# EAGLE design proto4-duplex (EAGLE 9.7.0)
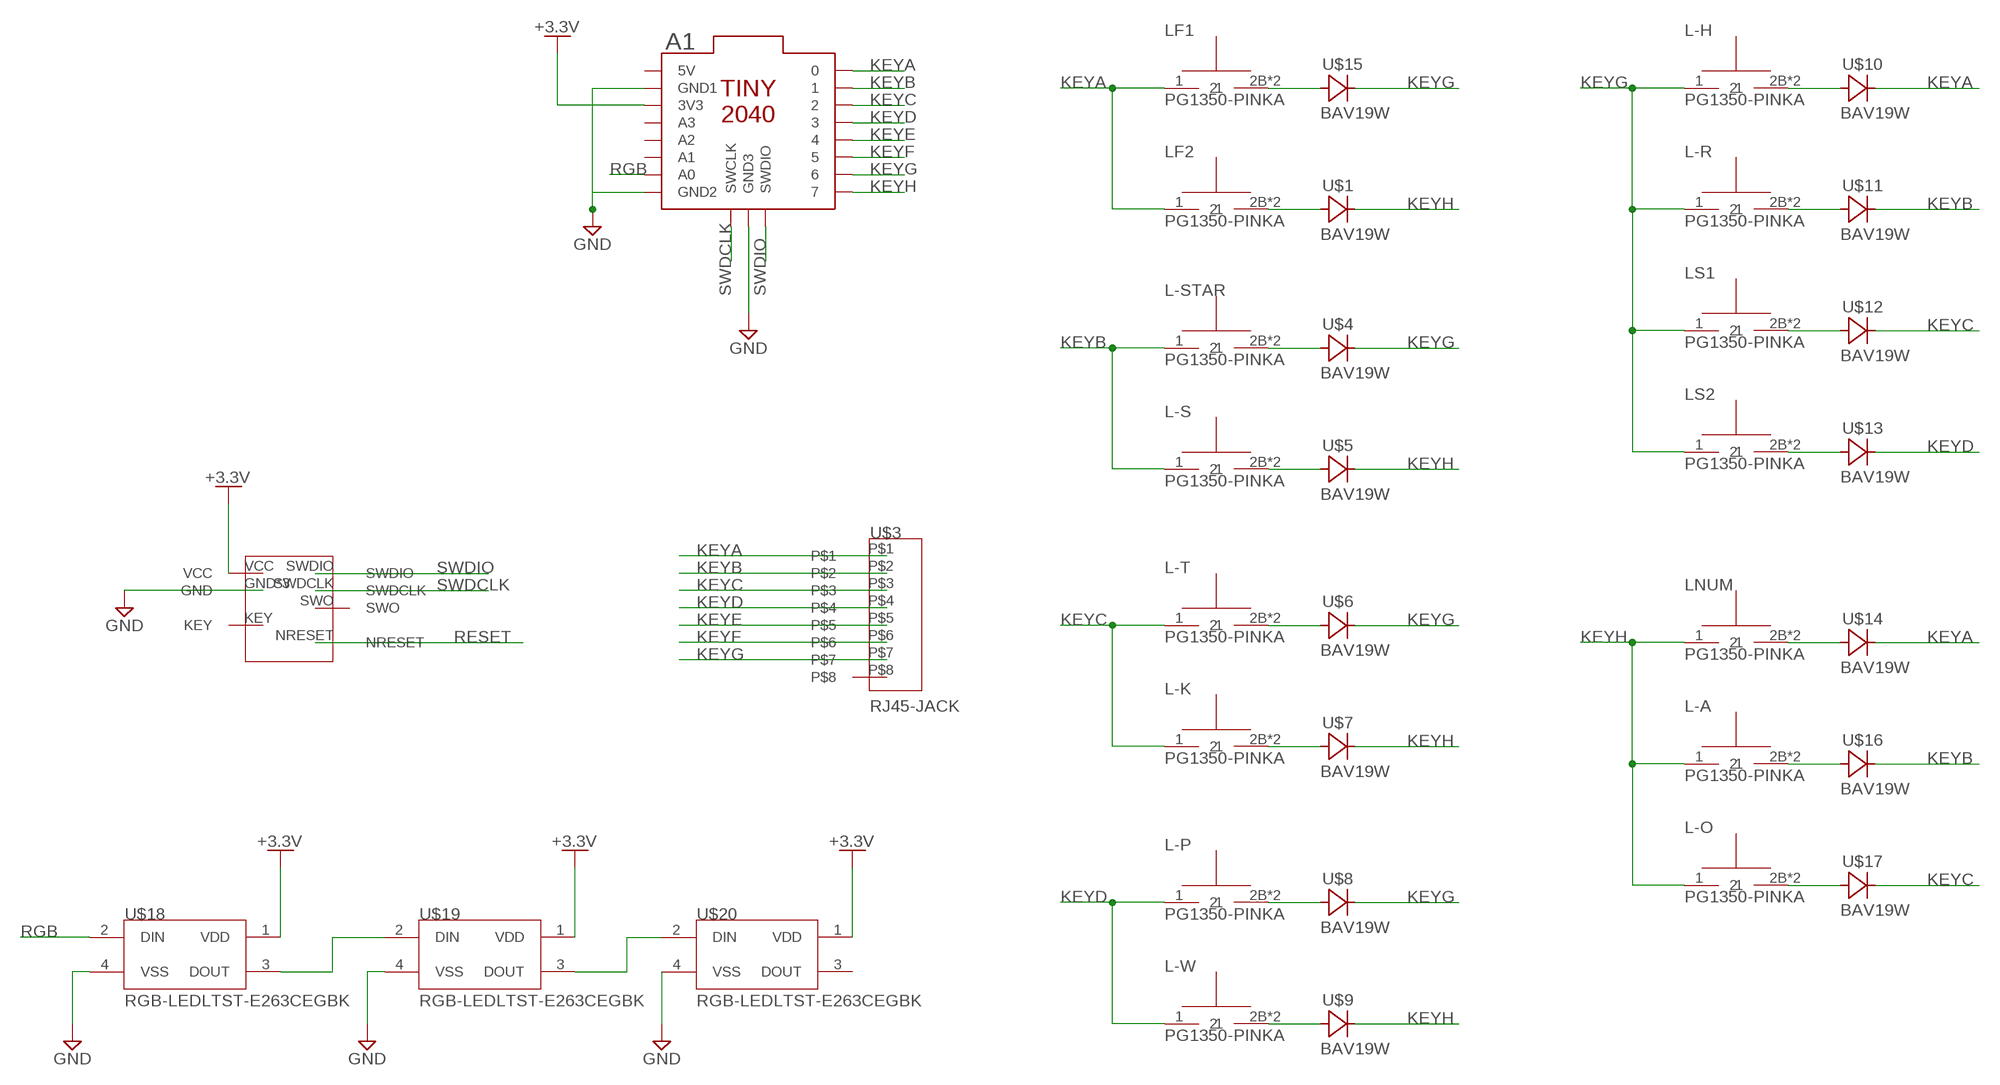
[diagram p0: schematic, sheet 1]

## Parts
A1  TINY2040  [TINY2040]
L-A  PG1350-PINKA  [PG1350]
L-H  PG1350-PINKA  [PG1350]
L-K  PG1350-PINKA  [PG1350]
L-O  PG1350-PINKA  [PG1350]
L-P  PG1350-PINKA  [PG1350]
L-R  PG1350-PINKA  [PG1350]
L-S  PG1350-PINKA  [PG1350]
L-STAR  PG1350-PINKA  [PG1350]
L-T  PG1350-PINKA  [PG1350]
L-W  PG1350-PINKA  [PG1350]
LF1  PG1350-PINKA  [PG1350]
LF2  PG1350-PINKA  [PG1350]
LNUM  PG1350-PINKA  [PG1350]
LS1  PG1350-PINKA  [PG1350]
LS2  PG1350-PINKA  [PG1350]
U$1  BAV19W  [SOD123]
U$2  CORTEX-M0  [CORTEX-M10]
U$3  RJ45-JACK  [C-BMJ-0051-RJ45]
U$4  BAV19W  [SOD123]
U$5  BAV19W  [SOD123]
U$6  BAV19W  [SOD123]
U$7  BAV19W  [SOD123]
U$8  BAV19W  [SOD123]
U$9  BAV19W  [SOD123]
U$10  BAV19W  [SOD123]
U$11  BAV19W  [SOD123]
U$12  BAV19W  [SOD123]
U$13  BAV19W  [SOD123]
U$14  BAV19W  [SOD123]
U$15  BAV19W  [SOD123]
U$16  BAV19W  [SOD123]
U$17  BAV19W  [SOD123]
U$18  RGB-LEDLTST-E263CEGBK  [DFN180X180X65-2]
U$19  RGB-LEDLTST-E263CEGBK  [DFN180X180X65-2]
U$20  RGB-LEDLTST-E263CEGBK  [DFN180X180X65-2]

## Nets
+3.3V: A1.3V3 U$18.1(VDD) U$19.1(VDD) U$20.1(VDD)
GND: A1.GND1 A1.GND2 A1.GND3 U$2.GND U$2.GND2(GND) U$2.GNDDETEC(GND) U$18.4(VSS) U$19.4(VSS) U$20.4(VSS)
KEYA: A1.0 LF1.1 LF2.1 U$3.P$1 U$10.C U$14.C
KEYB: A1.1 L-S.1 L-STAR.1 U$3.P$2 U$11.C U$16.C
KEYC: A1.2 L-K.1 L-T.1 U$3.P$3 U$12.C U$17.C
KEYD: A1.3 L-P.1 L-W.1 U$3.P$4 U$13.C
KEYE: A1.4 U$3.P$5
KEYF: A1.5 U$3.P$6
KEYG: A1.6 L-H.1 L-R.1 LS1.1 LS2.1 U$3.P$7 U$4.C U$6.C U$8.C U$15.C
KEYH: A1.7 L-A.1 L-O.1 LNUM.1 U$1.C U$5.C U$7.C U$9.C
N$1: LF1.2B LF1.2T U$15.A
N$2: LF2.2B LF2.2T U$1.A
N$3: L-STAR.2B L-STAR.2T U$4.A
N$4: L-S.2B L-S.2T U$5.A
N$5: L-T.2B L-T.2T U$6.A
N$6: L-K.2B L-K.2T U$7.A
N$7: L-P.2B L-P.2T U$8.A
N$8: L-W.2B L-W.2T U$9.A
N$9: L-H.2B L-H.2T U$10.A
N$10: L-R.2B L-R.2T U$11.A
N$11: LS1.2B LS1.2T U$12.A
N$12: LS2.2B LS2.2T U$13.A
N$13: LNUM.2B LNUM.2T U$14.A
N$14: L-A.2B L-A.2T U$16.A
N$15: L-O.2B L-O.2T U$17.A
N$16: U$18.3(DOUT) U$19.2(DIN)
N$17: U$19.3(DOUT) U$20.2(DIN)
RESET: U$2.NRESET
RGB: A1.A0 U$18.2(DIN)
SWDCLK: A1.SWCLK U$2.SWDCLK
SWDIO: A1.SWDIO U$2.SWDIO
Unconnected: A1.5V A1.A1 A1.A2 A1.A3 U$2.KEY U$2.SWO U$2.VCC U$3.P$8 U$20.3(DOUT)

## Library data of the parts
A1 = pimoroni-boards:TINY2040
L-A L-H L-K L-O L-P L-R L-S L-STAR L-T L-W LF1 LF2 LNUM LS1 LS2 = Keyboard Parts:PG1350-PINK
U$1 U$4-U$17 = Keyboard Parts:BAV19W
U$2 = Keyboard Parts:CORTEX-M0
U$3 = Keyboard Parts:RJ45-JACK
U$18-U$20 = Keyboard Parts:RGB-LED

## Board
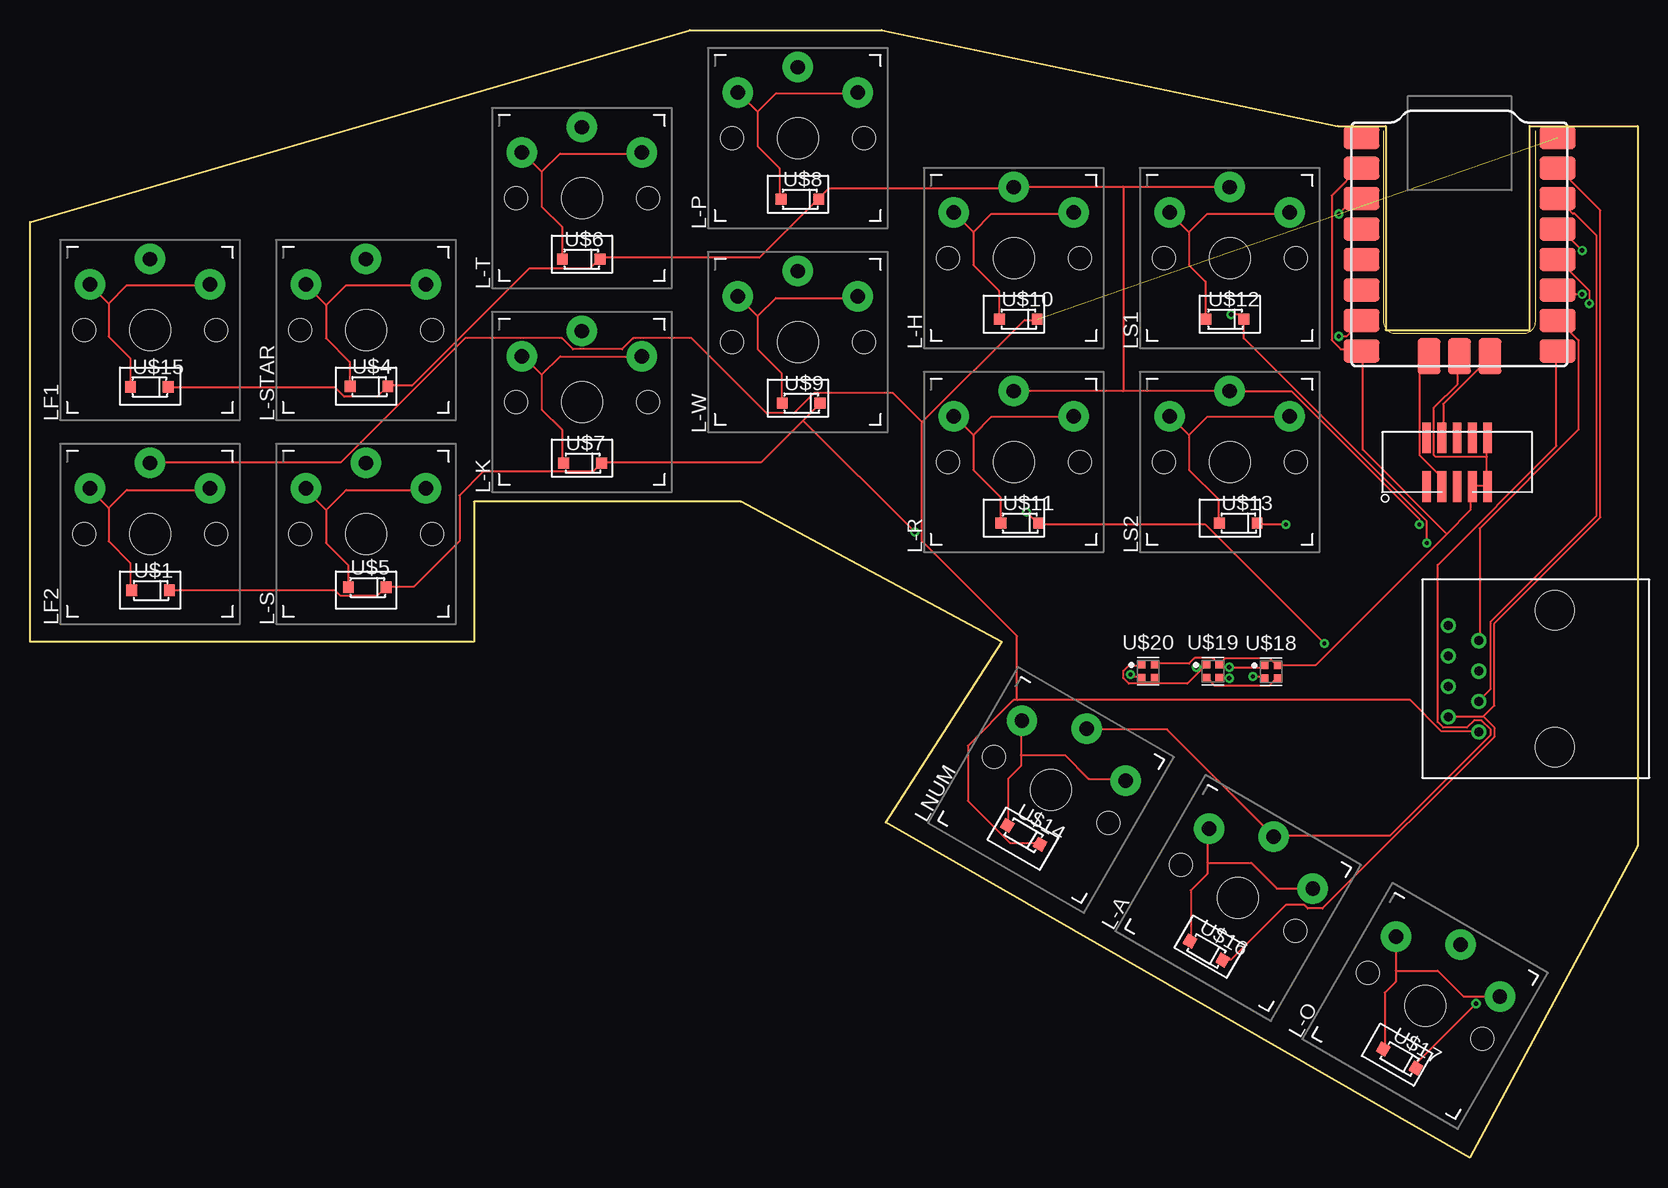
[diagram p1: board, top side]
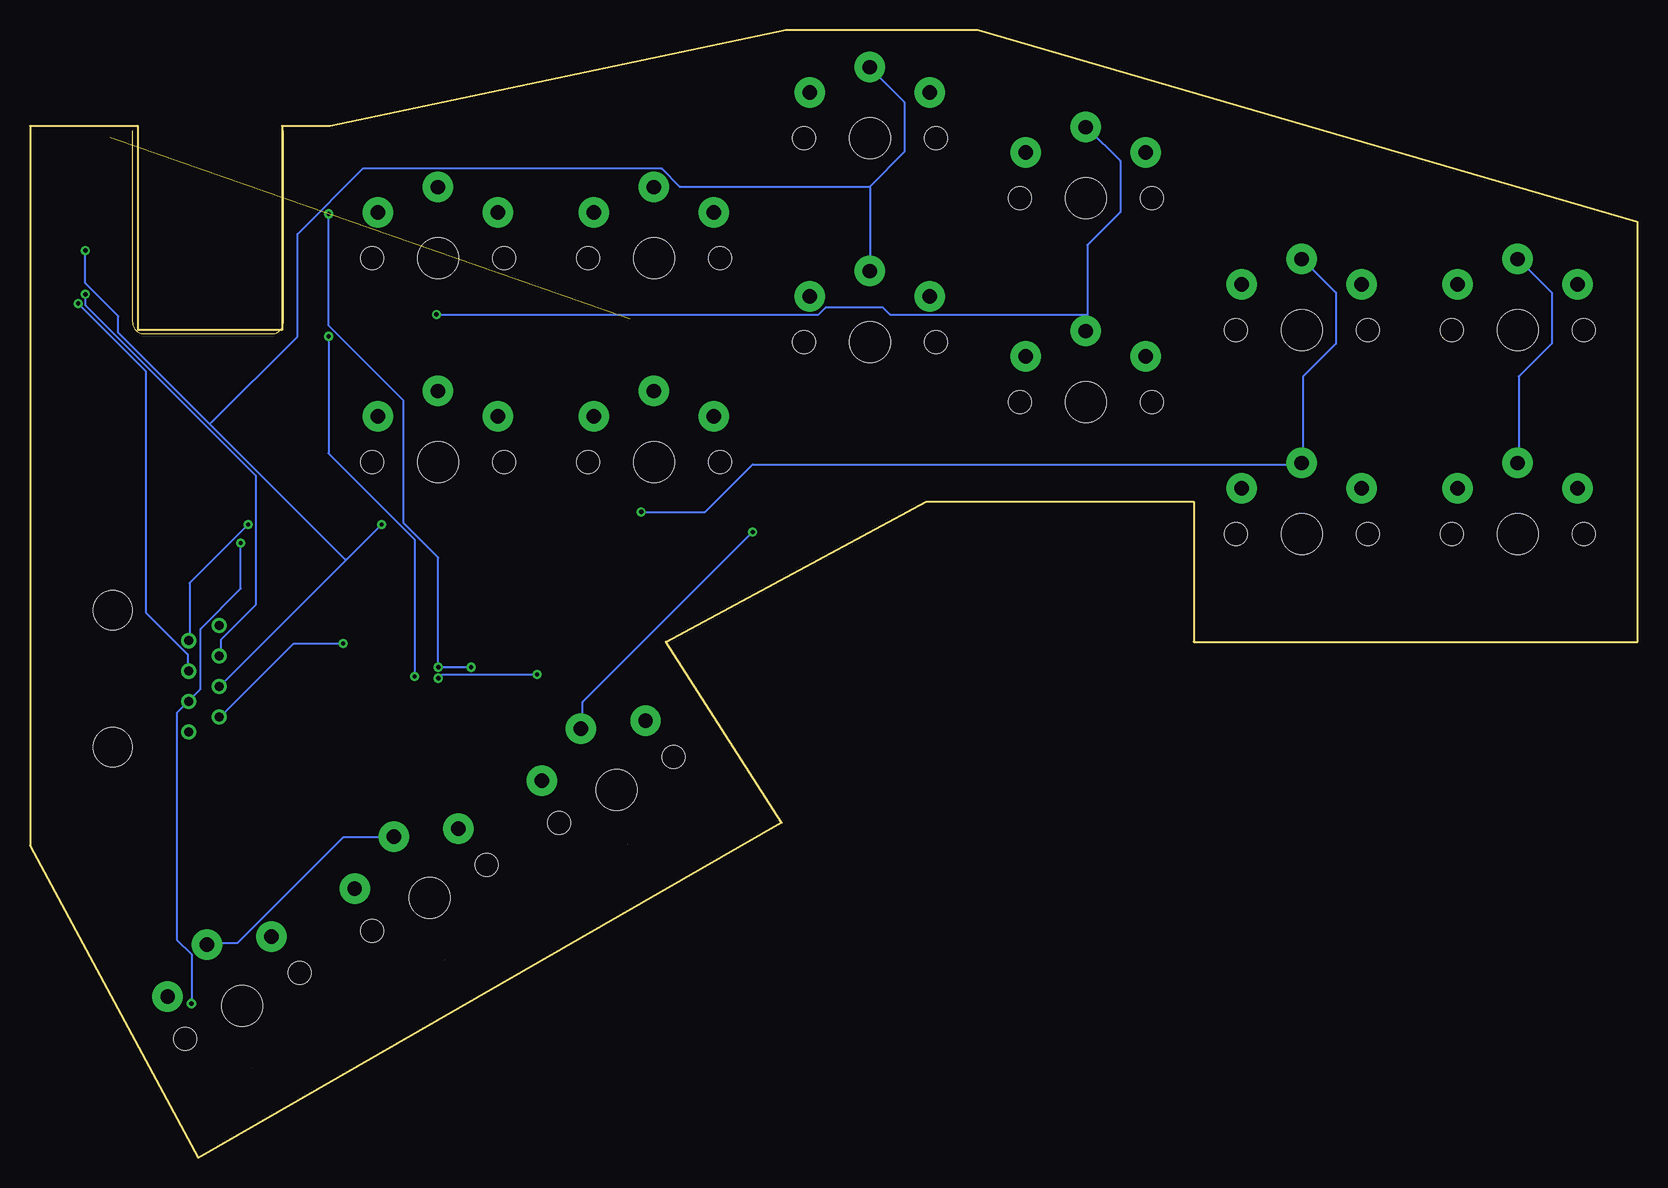
[diagram p2: board, bottom side, seen from below]

Size 134 x 94 mm. Coordinates in mm from the lower left corner, seen from the top.
Outline: 0,78 55,94 71,94 109,86 113,86 113,69 125,69 125,86 134,86 134,26 120,0 71.34,27.93 81,43 59.26,54.67 37,54.67 37,43 0,43 0,78
Copper layers (1*16): Top 0.035mm / dielectric 1.5mm / Bottom 0.035mm
Design rules "Fusion Electronics Design Rules": minimum track width 6mil, minimum drill 0.35mm, track to track 6mil, track to pad 6mil, pad to pad 6mil, via to via 6mil, smd to smd 6mil, copper to edge 40mil, drill to drill 6mil, minimum pad ring 10mil, minimum via ring 8mil, stop-mask expansion 4mil, vias tented up to drill 0mil, thermal gap 10mil

### Footprints (pad centres in the part's own frame; a part is rotated, then mirrored left to right if it is on the bottom)
TINY2040 = smd 1.9 x 3: 0 1.27,8.17; 1 3.81,8.17; 2 6.35,8.17; 3 8.89,8.17; 3V3 6.35,-8.17; 4 11.43,8.17; 5 13.97,8.17; 5V 1.27,-8.17; 6 16.51,8.17; 7 19.05,8.17; A0 16.51,-8.17; A1 13.97,-8.17; A2 11.43,-8.17; A3 8.89,-8.17; GND1 3.81,-8.17; GND2 19.05,-8.17 | smd 3 x 1.9: GND3 19.49,0; SWCLK 19.49,-2.54; SWDIO 19.49,2.54
PG1350 = drill 1.2 pad 2.54: 1 5.9,0; 2B 3.8,5; 2T 3.8,-5 | hole 3.4: 0,0 | hole 1.9: 0,5.5; 0,-5.5
SOD123 = smd 0.9 x 0.95: A -1.575,0; C 1.575,0
CORTEX-M10 = smd 2.55 x 0.74: GND -2.025,-2.54; GND2 2.025,-2.54; GNDDETEC -2.025,-1.27; KEY 2.025,-1.27; NC -2.025,0; NRESET 2.025,0; SWDCLK -2.025,1.27; SWDIO 2.025,1.27; SWO -2.025,2.54; VCC 2.025,2.54
C-BMJ-0051-RJ45 = drill 0.76: P$1 -3.81,0; P$2 -2.54,2.54; P$3 -1.27,0; P$4 0,2.54; P$5 1.27,0; P$6 2.54,2.54; P$7 3.81,0; P$8 5.08,2.54 | hole 3.25: -5.08,-6.35; 6.35,-6.35
DFN180X180X65-2 = smd 0.6 x 0.6: 1 -0.52,0.52; 2 -0.52,-0.52; 3 0.52,-0.52; 4 0.52,0.52

### Placement (x,y rotation side)
A1  119.16,86.29 270 top
L-A  100.71,21.63 60 top
L-H  82,75 90 top
L-K  46,63 90 top
L-O  116.29,12.63 60 top
L-P  64,85 90 top
L-R  82,58 90 top
L-S  28,52 90 top
L-STAR  28,69 90 top
L-T  46,80 90 top
L-W  64,68 90 top
LF1  10,69 90 top
LF2  10,52 90 top
LNUM  85.12,30.63 60 top
LS1  100,75 90 top
LS2  100,58 90 top
U$1  10.05,47.28 0 top
U$2  118.96,57.96 90 top
U$3  120.76,39.28 90 top
U$4  28.26,64.28 0 top
U$5  28.12,47.53 0 top
U$6  45.95,74.9 0 top
U$7  46.06,57.9 0 top
U$8  64.17,79.9 0 top
U$9  64.28,62.9 0 top
U$10  82.39,69.9 0 top
U$11  82.5,52.9 0 top
U$12  99.61,69.9 0 top
U$13  100.72,52.9 0 top
U$14  82.83,26.9 330 top
U$15  9.95,64.25 0 top
U$16  98.06,17.25 330 top
U$17  114.17,8.25 330 top
U$18  103.45,40.5 0 top
U$19  98.6,40.55 0 top
U$20  93.2,40.55 0 top

### Tracks (layer width: path | path; a pad name or v marks a point on that pad's centre or on a via)
+3.3V  (via drill 0.35)
  Top 0.152: 97.53,40.57 97.98,41.02 U$19.1 | 97.53,40.57 96.46,39.5 91.58,39.5 91.13,39.96 91.13,40.57 91.58,41.02 92.65,41.02 U$20.1 | v99.97,40.87 102.86,40.87 U$18.1 | 97.53,40.57 v97.22,40.87 | v109.11,78.67 110.33,79.89 110.94,79.89 A1.3V3
  Bottom 0.152: v97.22,40.87 v99.97,40.87 99.97,50.02 102.86,52.91 102.86,63.12 109.11,69.37 v109.11,78.67
GND
  Top 0.152: A1.GND1 110.94,82.63 108.5,80.19 108.5,68.15 109.26,67.39 110.94,67.39 A1.GND2 111.09,67.24 111.09,59.01 118.1,52 | U$20.4 93.87,41.18 96.61,41.18 97.07,41.64 98.59,41.64 99.05,41.18 U$19.4 99.2,41.18 99.66,41.64 103.32,41.64 103.93,41.02 U$18.4 104.08,41.02 107.13,41.02 118.1,52 | 121.45,55.96 120.24,55.96 U$2.GNDDETEC 120.08,55.81 120.08,53.98 118.1,52 | 121.45,55.96 121.45,58.4 | 121.45,58.4 121.45,59.92 U$2.GND2 | 121.45,55.96 U$2.GND | 121.45,58.4 117.19,58.4 117.03,58.55 117.03,62.51 119.02,64.5 119.02,66.78 A1.GND3
KEYA  (2 unrouted)
  Top 0.152: 82.29,38.13 115.05,38.13 117.65,35.54 120.69,35.54 U$3.P$1 | 82.29,38.13 81.98,38.13 78.17,34.32 78.17,29.75 81.68,26.24 84.12,26.24 U$14.C | 74.36,61.29 82.9,69.83 83.96,69.83 U$10.C | 74.36,61.29 74.36,51.39 82.29,43.46 82.29,38.13 | 74.36,61.29 71.92,63.73 65.37,63.73 63.7,62.06 61.41,62.06 55.16,68.31 50.28,68.31 49.37,67.39 45.25,67.39 44.34,68.31 36.26,68.31 25.9,57.94 10.05,57.94 LF2.1
  Bottom 0.152: LF2.1 9.9,57.94 9.9,65.1 7.16,67.85 7.16,72.11 9.9,74.86 LF1.1
KEYB  (via drill 0.35)  (1 unrouted)
  Top 0.152: v107.89,42.85 97.98,52.76 84.12,52.76 U$11.C 83.96,52.91 v83.05,53.83 | 121.15,36.76 122.06,35.84 122.06,35.08 107.74,20.76 106.52,20.76 106.22,21.06 104.69,21.06 100.12,16.49 99.51,16.49 U$16.C | 121.15,36.76 118.25,36.76 U$3.P$2 | 121.15,36.76 122.06,37.67 122.06,44.53 130.9,53.37 130.9,78.97 127.4,82.48 A1.1
  Bottom 0.152: L-STAR.1 27.88,74.86 25.14,72.11 25.14,67.85 27.88,65.1 27.88,57.94 L-S.1 28.03,57.79 73.75,57.79 77.72,53.83 v83.05,53.83 | v107.89,42.85 112.01,42.85 118.1,36.76 U$3.P$2
KEYC  (via drill 0.35)  (1 unrouted)
  Top 0.152: v120.54,12.83 115.66,7.95 115.66,7.5 U$17.C | v116.43,51.24 116.43,53.06 101.19,68.31 101.19,69.83 U$12.C 101.03,69.98 100.73,70.29 v100.12,70.29 | A1.2 127.4,79.89 128.62,78.67 128.77,78.67 130.6,76.84 130.6,53.52 121.76,44.68 121.76,39.04 120.84,38.13 U$3.P$3
  Bottom 0.152: 45.86,70.29 45.86,76.08 43.12,78.82 43.12,83.09 45.86,85.83 L-T.1 | 45.86,70.29 45.86,68.91 L-K.1 | v120.54,12.83 120.54,16.95 121.76,18.16 121.76,37.06 120.84,37.98 U$3.P$3 120.69,38.13 119.78,39.04 119.78,44.07 116.43,47.43 v116.43,51.24 | 45.86,70.29 62.32,70.29 62.93,70.9 67.66,70.9 68.27,70.29 v100.12,70.29
KEYD  (via drill 0.35)
  Top 0.152: v104.69,52.76 102.41,52.76 U$13.C | v129.38,75.62 127.7,77.3 127.4,77.3 A1.3
  Bottom 0.152: 64,80.95 L-W.1 | 64,80.95 61.1,83.85 61.1,87.96 64,90.86 L-P.1 | 107.59,49.86 118.1,39.35 U$3.P$4 | 107.59,49.86 v104.69,52.76 | v129.38,75.62 129.38,72.88 126.64,70.13 126.64,68.76 119.02,61.14 | 119.02,61.14 107.74,49.86 107.59,49.86 | 64,80.95 79.85,80.95 81.37,82.48 106.22,82.48 111.7,76.99 111.7,68.46 119.02,61.14
KEYE  (via drill 0.35)
  Top 0.152: v129.99,71.2 129.99,72.27 127.4,74.86 A1.4
  Bottom 0.152: v129.99,71.2 124.35,65.56 124.35,45.45 120.84,41.94 120.84,40.57 U$3.P$5
KEYF  (via drill 0.35)
  Top 0.152: v129.38,71.96 127.7,71.96 127.4,72.27 A1.5
  Bottom 0.152: v129.38,71.96 129.38,71.05 115.21,56.88 115.21,46.05 118.1,43.16 118.1,41.94 U$3.P$6
KEYG  (via drill 0.35)
  Top 0.152: U$3.P$7 120.84,43.16 120.84,52.45 129.07,60.69 129.07,68.15 127.4,69.83 A1.6 | 91.13,63.88 99.97,63.88 LS2.1 100.12,63.88 105.15,63.88 115.82,53.22 v115.82,52.76 | 91.13,63.88 82.14,63.88 L-R.1 | U$15.C 11.57,64.19 25.44,64.19 26.2,63.43 28.95,63.43 29.71,64.19 U$4.C 29.86,64.34 31.84,64.34 41.6,74.1 46.63,74.1 47.39,74.86 U$6.C 47.54,75.01 60.8,75.01 65.68,79.89 U$8.C 65.83,80.04 66.59,80.8 81.98,80.8 L-H.1 82.14,80.95 91.13,80.95 | 91.13,80.95 99.97,80.95 LS1.1 | 91.13,80.95 91.13,63.88
  Bottom 0.152: v115.82,52.76 120.69,47.88 120.69,43.16 U$3.P$7
KEYH  (via drill 0.35)
  Top 0.152: U$1.C 11.73,47.27 25.44,47.27 25.9,46.82 28.95,46.82 29.56,47.43 U$5.C 29.71,47.58 32,47.58 35.81,51.39 35.81,55.2 37.79,57.18 46.93,57.18 47.54,57.79 U$7.C 47.69,57.94 60.95,57.94 64.46,61.45 | 64.46,61.45 65.83,62.82 U$9.C | A1.7 127.25,67.24 127.25,59.31 117.34,49.41 117.34,36.3 117.8,35.84 119.78,35.84 120.39,36.45 121,36.45 121.76,35.69 121.76,35.23 113.38,26.85 103.78,26.85 L-A.1 103.62,26.85 94.78,35.69 88.08,35.69 LNUM.1 | v73.75,52.15 64.46,61.45
  Bottom 0.152: L-O.1 119.17,17.86 116.73,17.86 107.89,26.7 103.78,26.7 L-A.1 | v73.75,52.15 87.93,37.98 87.93,35.84 LNUM.1
N$1
  Top 0.152: 6.55,71.2 6.55,68.46 8.37,66.63 8.37,64.34 U$15.A | 6.55,71.2 5.02,72.72 LF1.2B | 6.55,71.2 8.07,72.72 14.93,72.72 LF1.2T
N$2
  Top 0.152: 6.55,54.13 6.55,51.39 8.37,49.56 8.37,47.43 U$1.A | 6.55,54.13 5.02,55.66 LF2.2B | 6.55,54.13 8.07,55.66 14.93,55.66 LF2.2T
N$3
  Top 0.152: 24.68,71.05 24.68,68.31 26.66,66.32 26.66,64.34 U$4.A | 24.68,71.05 23,72.72 L-STAR.2B | 24.68,71.05 26.36,72.72 32.91,72.72 L-STAR.2T
N$4
  Top 0.152: 24.68,53.98 24.68,51.24 26.51,49.41 26.51,47.58 U$5.A | 24.68,53.98 23,55.66 L-S.2B | 24.68,53.98 26.36,55.66 32.91,55.66 L-S.2T
N$5
  Top 0.152: 42.66,82.17 42.66,79.28 44.34,77.6 44.34,75.01 U$6.A | 42.66,82.17 41.14,83.7 L-T.2B | 42.66,82.17 44.19,83.7 50.89,83.7 L-T.2T
N$6
  Top 0.152: 42.66,65.26 42.66,62.36 44.34,60.69 44.34,57.94 U$7.A | 42.66,65.26 41.14,66.78 L-K.2B | 42.66,65.26 44.19,66.78 50.89,66.78 L-K.2T
N$7
  Top 0.152: 60.65,87.2 60.65,84.31 62.48,82.48 62.48,80.04 U$8.A | 60.65,87.2 59.12,88.73 L-P.2B | 60.65,87.2 62.17,88.73 68.88,88.73 L-P.2T
N$8
  Top 0.152: 60.65,70.13 60.65,67.39 62.63,65.41 62.63,62.97 U$9.A | 60.65,70.13 59.12,71.66 L-W.2B | 60.65,70.13 62.17,71.66 68.88,71.66 L-W.2T
N$9
  Top 0.152: 78.63,77.14 78.63,74.4 80.76,72.27 80.76,69.98 U$10.A | 78.63,77.14 77.11,78.67 L-H.2B | 78.63,77.14 80.15,78.67 86.86,78.67 L-H.2T
N$10
  Top 0.152: 78.63,60.23 78.63,57.33 80.92,55.05 80.92,52.91 U$11.A | 78.63,60.23 77.11,61.75 L-R.2B | 78.63,60.23 80.15,61.75 86.86,61.75 L-R.2T
N$11
  Top 0.152: 96.61,77.14 96.61,74.4 97.98,73.03 97.98,69.98 U$12.A | 96.61,77.14 95.09,78.67 LS1.2B | 96.61,77.14 98.14,78.67 105,78.67 LS1.2T
N$12
  Top 0.152: 96.61,60.23 96.61,57.33 99.05,54.89 99.05,52.91 U$13.A | 96.61,60.23 95.09,61.75 LS2.2B | 96.61,60.23 98.14,61.75 105,61.75 LS2.2T
N$13
  Top 0.152: 82.59,33.56 82.59,36.3 LNUM.2B | 82.59,33.56 82.59,32.64 81.53,31.58 81.53,27.77 U$14.A | 82.59,33.56 86.25,33.56 88.23,31.58 91.28,31.58 LNUM.2T
N$14
  Top 0.152: 98.14,24.57 98.14,27.31 L-A.2B | 98.14,24.57 98.14,23.65 96.77,22.28 96.77,18.16 U$16.A | 98.14,24.57 101.8,24.57 103.93,22.43 106.82,22.43 L-A.2T
N$15
  Top 0.152: 113.84,15.57 113.84,18.32 L-O.2B | 113.84,15.57 113.84,14.66 112.92,13.75 112.92,9.17 U$17.A | 113.84,15.57 117.34,15.57 119.47,13.44 122.52,13.44 L-O.2T
N$16
  Top 0.152: U$18.3 103.93,39.96 103.32,39.35 98.75,39.35 98.14,39.96 U$19.2
N$17  (via drill 0.35)
  Top 0.152: v91.74,40.26 91.89,40.11 92.65,40.11 U$20.2 | v99.97,39.96 99.2,39.96 U$19.3
  Bottom 0.152: v91.74,40.26 99.66,40.26 v99.97,39.96
RGB  (via drill 0.35)
  Top 0.152: v101.95,40.11 102.86,40.11 U$18.2 | v109.11,68.46 109.72,68.46 110.94,69.68 A1.A0
  Bottom 0.152: v101.95,40.11 101.95,51.54 109.11,58.7 v109.11,68.46
SWDCLK
  Top 0.152: U$2.SWDCLK 117.65,55.96 117.65,56.72 115.82,58.55 115.82,66.02 116.58,66.78 A1.SWCLK
SWDIO
  Top 0.152: U$2.SWDIO 117.8,60.08 117.8,62.82 121.76,66.78 A1.SWDIO